# EAGLE design schema (EAGLE 5.11)
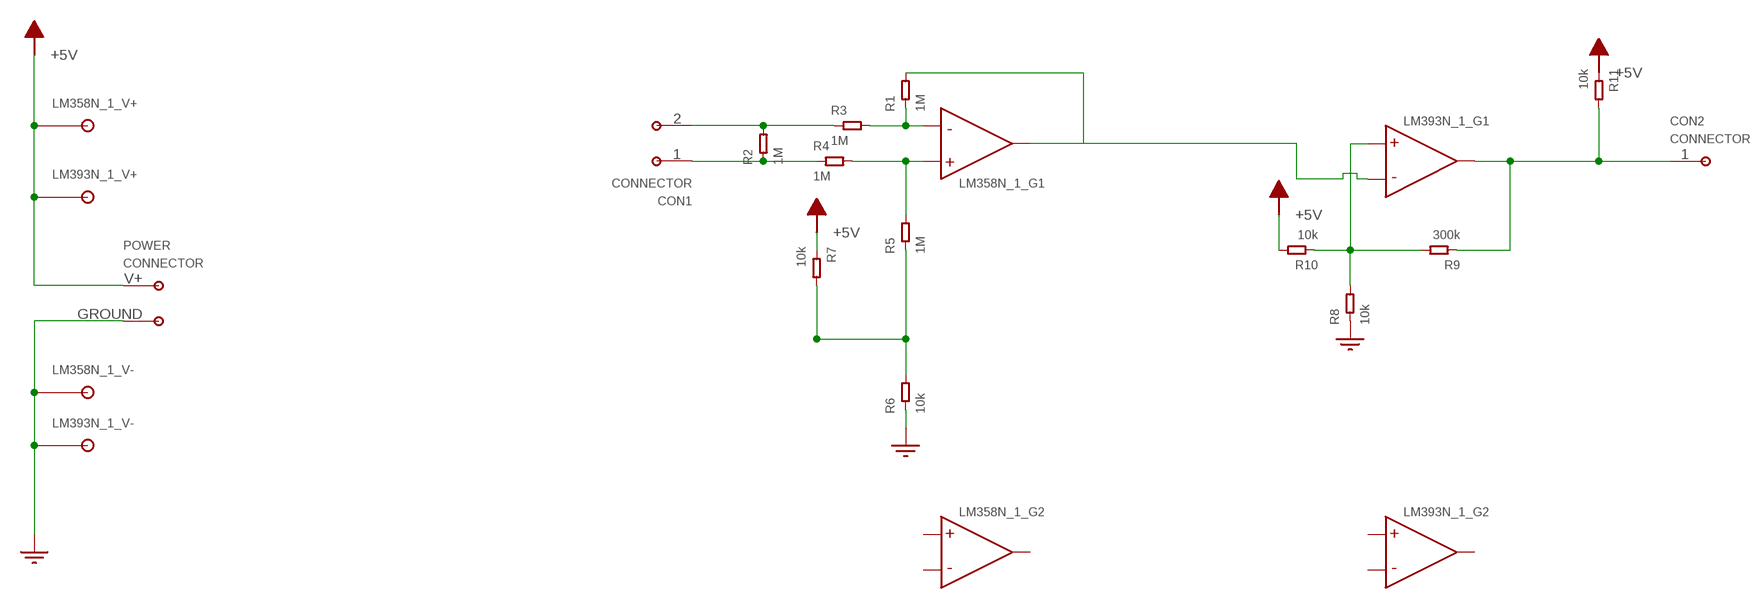
[diagram p0: schematic, sheet 1]

## Parts
CON1  2_PIN_CONNECTORGENERIC  [2_PIN_CONNECTOR]
CON2  1_PIN_CONNECTOR  [1_PIN_CONNECTOR]
LM358N_1  LM358DIL8  [DIL08]
LM393N_1  LM393N  [DIL08]
POWER  2_PIN_CONNECTOR  [2_PIN_GENERIC_POWER_CONNECTOR]
R1  1M  R12MM_RASTER_AXIAL  [0207/12]
R2  1M  R12MM_RASTER_AXIAL  [0207/12]
R3  1M  R12MM_RASTER_AXIAL  [0207/12]
R4  1M  R12MM_RASTER_AXIAL  [0207/12]
R5  1M  R12MM_RASTER_AXIAL  [0207/12]
R6  10k  R12MM_RASTER_AXIAL  [0207/12]
R7  10k  R12MM_RASTER_AXIAL  [0207/12]
R8  10k  R12MM_RASTER_AXIAL  [0207/12]
R9  300k  R12MM_RASTER_AXIAL  [0207/12]
R10  10k  R12MM_RASTER_AXIAL  [0207/12]
R11  10k  R12MM_RASTER_AXIAL  [0207/12]

## Nets
+5V: LM358N_1.8(_V+:SUPPLYPIN) LM393N_1.8(_V+:SUPPLYPIN) POWER.V+ R7.1 R10.2 R11.1
GND: LM358N_1.4(_V-:SUPPLYPIN) LM393N_1.4(_V-:SUPPLYPIN) POWER.GROUND R6.1 R8.1
N$1: R5.1 R6.2 R7.2
N$2: LM358N_1.2(_G1:-) R1.1 R3.2
N$3: LM358N_1.1(_G1:OUT) LM393N_1.2(_G1:-) R1.2
N$4: CON1.2 R2.2 R3.1
N$5: CON1.1 R2.1 R4.1
N$6: LM358N_1.3(_G1:+) R4.2 R5.2
N$7: LM393N_1.3(_G1:+) R8.2 R9.2 R10.1
N$9: CON2.1 LM393N_1.1(_G1:OUT) R9.1 R11.2
Unconnected: LM358N_1.5(_G2:+) LM358N_1.6(_G2:-) LM358N_1.7(_G2:OUT) LM393N_1.5(_G2:+) LM393N_1.6(_G2:-) LM393N_1.7(_G2:OUT)

## Library data of the parts
CON1 POWER = library:2_PIN_CONNECTOR
CON2 = library:1_PIN_CONNECTOR
LM358N_1 = library:LM358
LM393N_1 = library:LM393N
R1-R11 = library:R

## Board
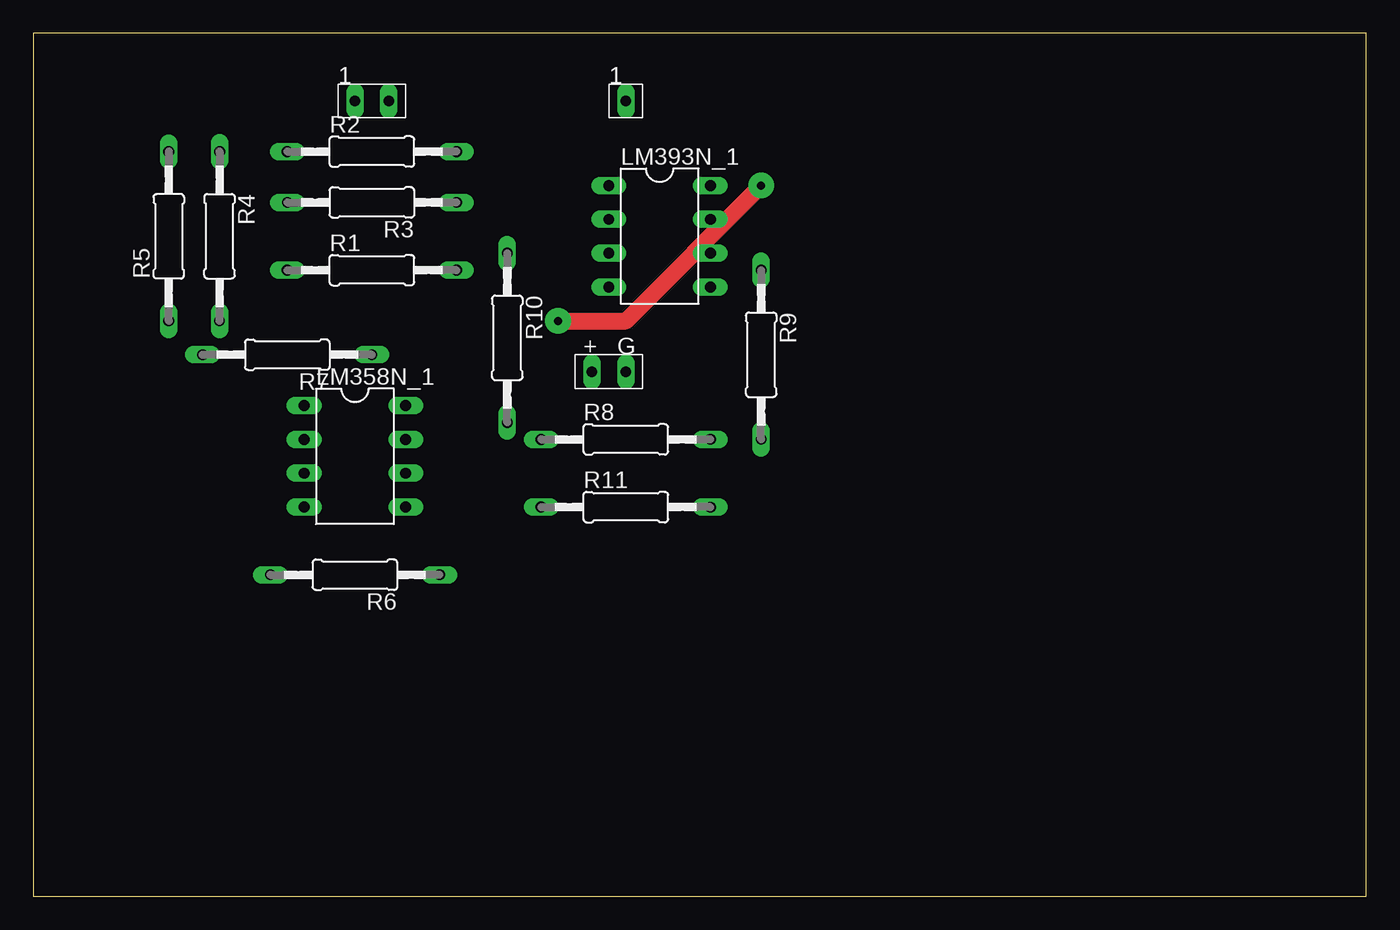
[diagram p1: board, top side]
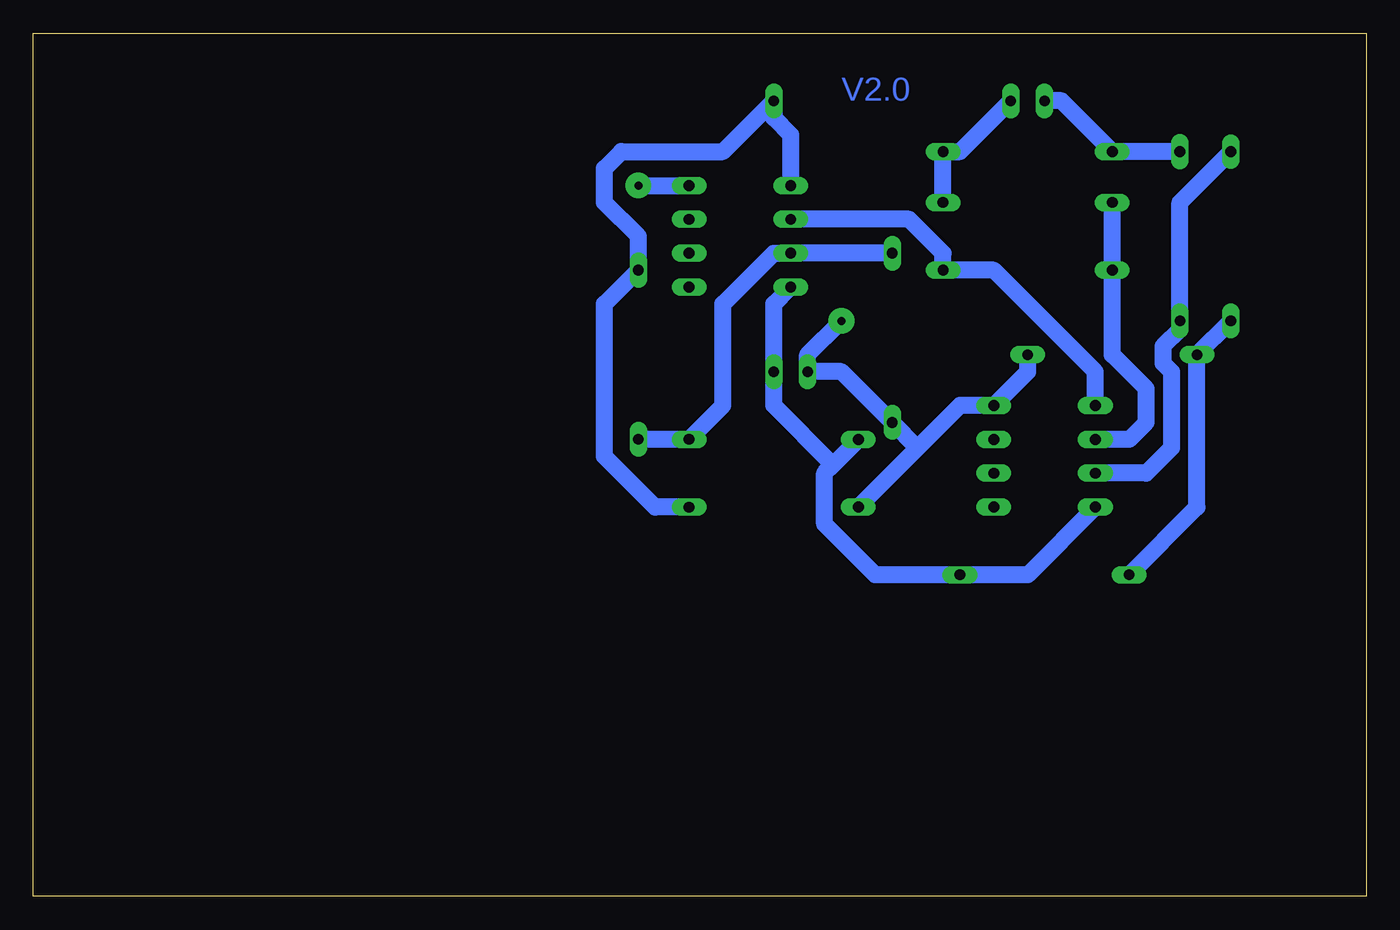
[diagram p2: board, bottom side, seen from below]

Size 100 x 64.76 mm. Coordinates in mm from the lower left corner, seen from the top.
Outline: 0,0 100,0 100,64.76 0,64.76 0,0
Copper layers (1*16): Top 0.035mm / dielectric 1.5mm / Bottom 0.035mm
Design rules "default": minimum track width 10mil, minimum drill 24mil, track to track 8mil, track to pad 8mil, pad to pad 8mil, via to via 8mil, smd to smd 8mil, copper to edge 40mil, drill to drill 8mil, minimum pad ring 10mil, minimum via ring 8mil, stop-mask expansion 4mil, vias tented up to drill 0mil, thermal gap 10mil

### Footprints (pad centres in the part's own frame; a part is rotated, then mirrored left to right if it is on the bottom)
2_PIN_CONNECTOR = drill 0.8 long: 1 0,0; 2 2.54,0
1_PIN_CONNECTOR = drill 0.8 long: 1 0,0
DIL08 = drill 0.813 long: 1 -3.81,-3.81; 2 -1.27,-3.81; 3 1.27,-3.81; 4 3.81,-3.81; 5 3.81,3.81; 6 1.27,3.81; 7 -1.27,3.81; 8 -3.81,3.81
2_PIN_GENERIC_POWER_CONNECTOR = drill 0.8 long: GROUND 2.54,0; V+ 0,0
0207/12 = drill 0.813 long: 1 -6.35,0 | drill 0.8 long: 2 6.35,0

### Placement (x,y rotation side)
CON1  24.13,59.69 0 top
CON2  44.45,59.69 0 top
LM358N_1  24.13,33.02 270 top
LM393N_1  46.99,49.53 270 top
POWER  41.91,39.37 0 top
R1  25.4,46.99 0 top
R2  25.4,55.88 0 top
R3  25.4,52.07 180 top
R4  13.97,49.53 270 top
R5  10.16,49.53 90 top
R6  24.13,24.13 180 top
R7  19.05,40.64 180 top
R8  44.45,34.29 0 top
R9  54.61,40.64 270 top
R10  35.56,41.91 270 top
R11  44.45,29.21 0 top

### Tracks (layer width: path | path; a pad name or v marks a point on that pad's centre or on a via)
+5V  (via drill 0.6 pad 1.93)
  Top 1.27: v39.37,43.18 44.45,43.18 v54.61,53.34
  Bottom 1.27: R7.1 25.4,39.37 LM358N_1.8 30.48,36.83 33.66,33.66 | 33.66,33.66 R11.1 | 33.66,33.66 R10.2 39.37,39.37 POWER.V+ 41.91,40.64 v39.37,43.18 | v54.61,53.34 LM393N_1.8
GND
  Bottom 1.27: LM358N_1.4 25.4,24.13 R6.1 36.83,24.13 40.64,27.94 40.64,31.75 40.01,32.38 | 40.01,32.38 R8.1 | LM393N_1.4 44.45,44.45 POWER.GROUND 44.45,36.83 40.01,32.38
N$1
  Bottom 1.27: R5.1 R7.2 12.7,29.21 R6.2
N$2
  Bottom 1.27: R3.2 R1.1 19.05,40.64 16.51,38.1 16.51,35.56 17.78,34.29 LM358N_1.2
N$3
  Bottom 1.27: LM358N_1.1 20.32,39.37 27.94,46.99 R1.2 31.75,48.26 34.29,50.8 LM393N_1.2
N$4
  Bottom 1.27: R3.1 R2.2 30.48,55.88 CON1.2
N$5
  Bottom 1.27: CON1.1 22.86,59.69 R2.1 R4.1
N$6
  Bottom 1.27: LM358N_1.3 16.51,31.75 14.61,33.66 14.61,39.37 15.24,40.01 15.24,41.27 13.97,42.55 R4.2 13.97,52.07 R5.2
N$7
  Bottom 1.27: R9.2 R8.2 48.26,36.83 48.26,44.45 44.45,48.26 LM393N_1.3 R10.1
N$9
  Bottom 1.27: LM393N_1.1 43.18,57.15 44.45,58.42 CON2.1 48.26,55.88 55.88,55.88 57.15,54.61 57.15,52.07 54.61,49.53 R9.1 57.15,44.45 57.15,33.02 53.34,29.21 R11.2

### Text on the board
Bottom: V2.0